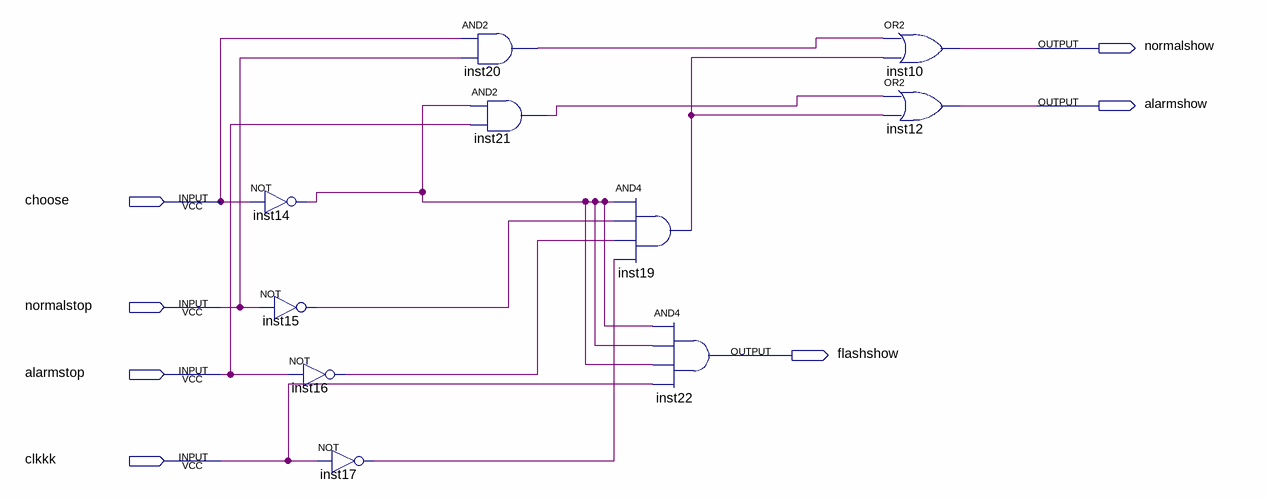
[diagram p0: schematic sheet]
// Quartus schematic choose.bdf as structural Verilog: 10 symbols, 7 pins
module choose (
  input  choose,
  input  normalstop,
  input  alarmstop,
  input  clkkk,
  output normalshow,
  output alarmshow,
  output flashshow
);

  wire inst14_out, inst15_out, inst16_out, inst17_out, inst19_out, inst20_out, inst21_out;

  not inst14 (inst14_out, choose);
  not inst15 (inst15_out, normalstop);
  not inst16 (inst16_out, alarmstop);
  not inst17 (inst17_out, clkkk);
  and inst20 (inst20_out, choose, normalstop);
  and inst21 (inst21_out, inst14_out, alarmstop);
  and inst19 (inst19_out, inst14_out, inst15_out, inst16_out, inst17_out);
  and inst22 (flashshow, inst14_out, inst14_out, inst14_out, clkkk);
  or inst10 (normalshow, inst20_out, inst19_out);
  or inst12 (alarmshow, inst21_out, inst19_out);
endmodule
